# EAGLE design Frankie_DIYRevB (EAGLE 9.3.0)
FRANKIE 1.0
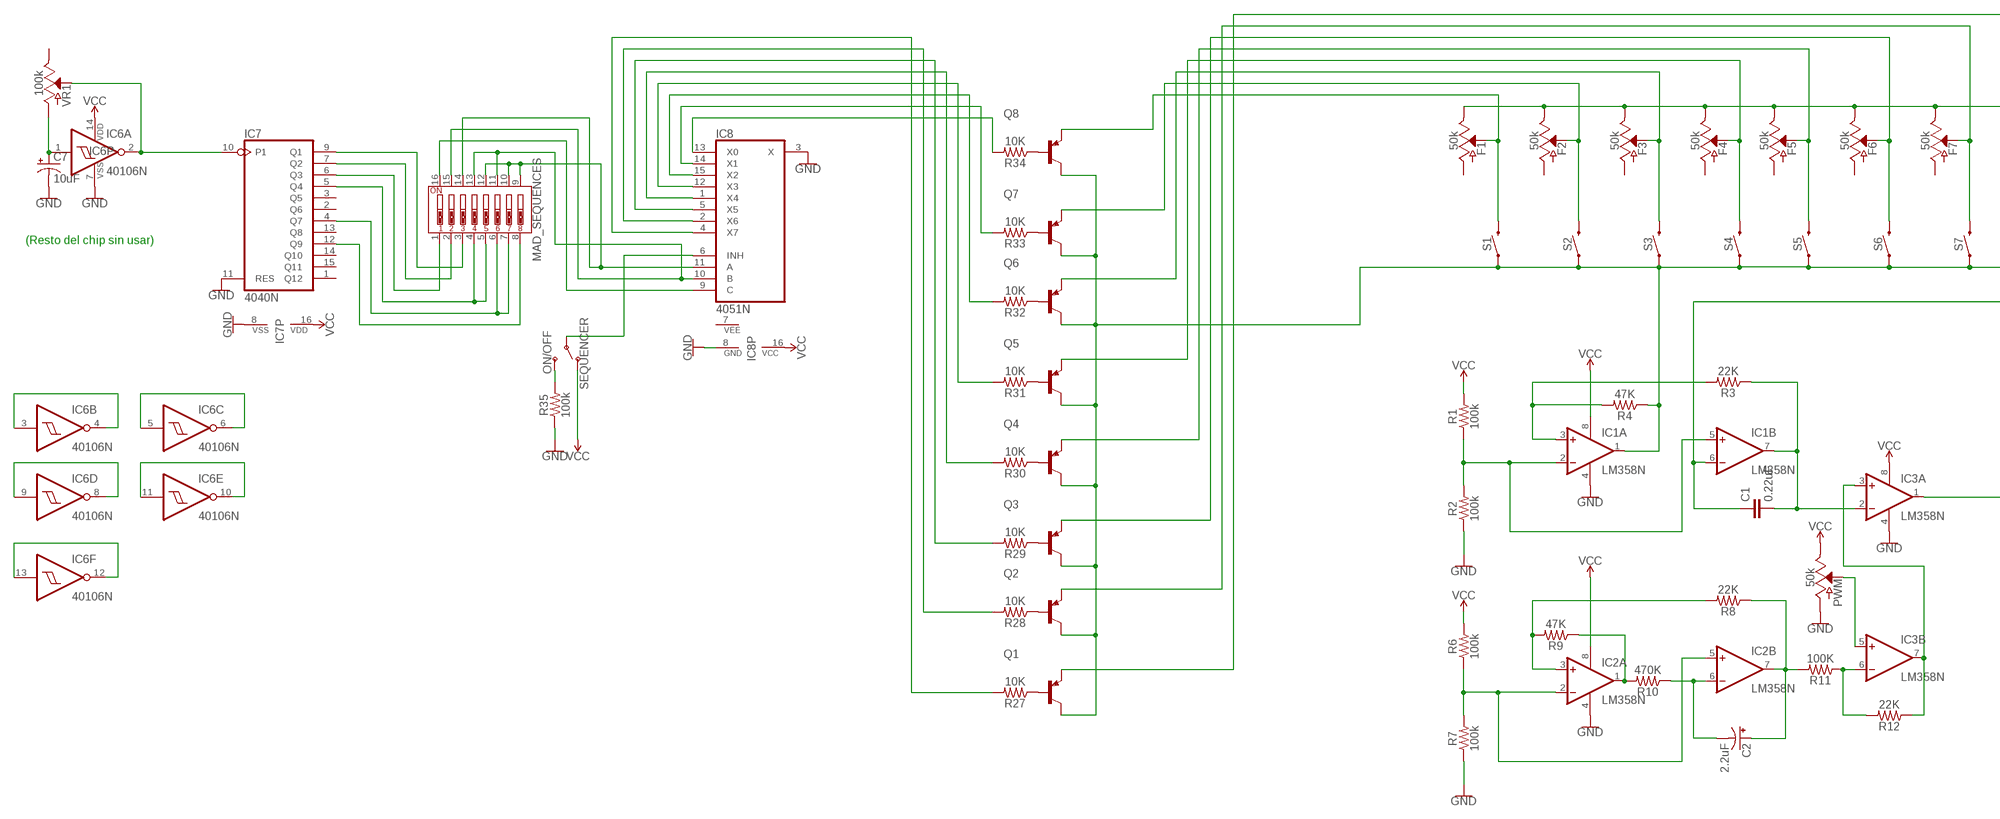
[diagram p0: schematic, sheet 1, part 1 of 2]
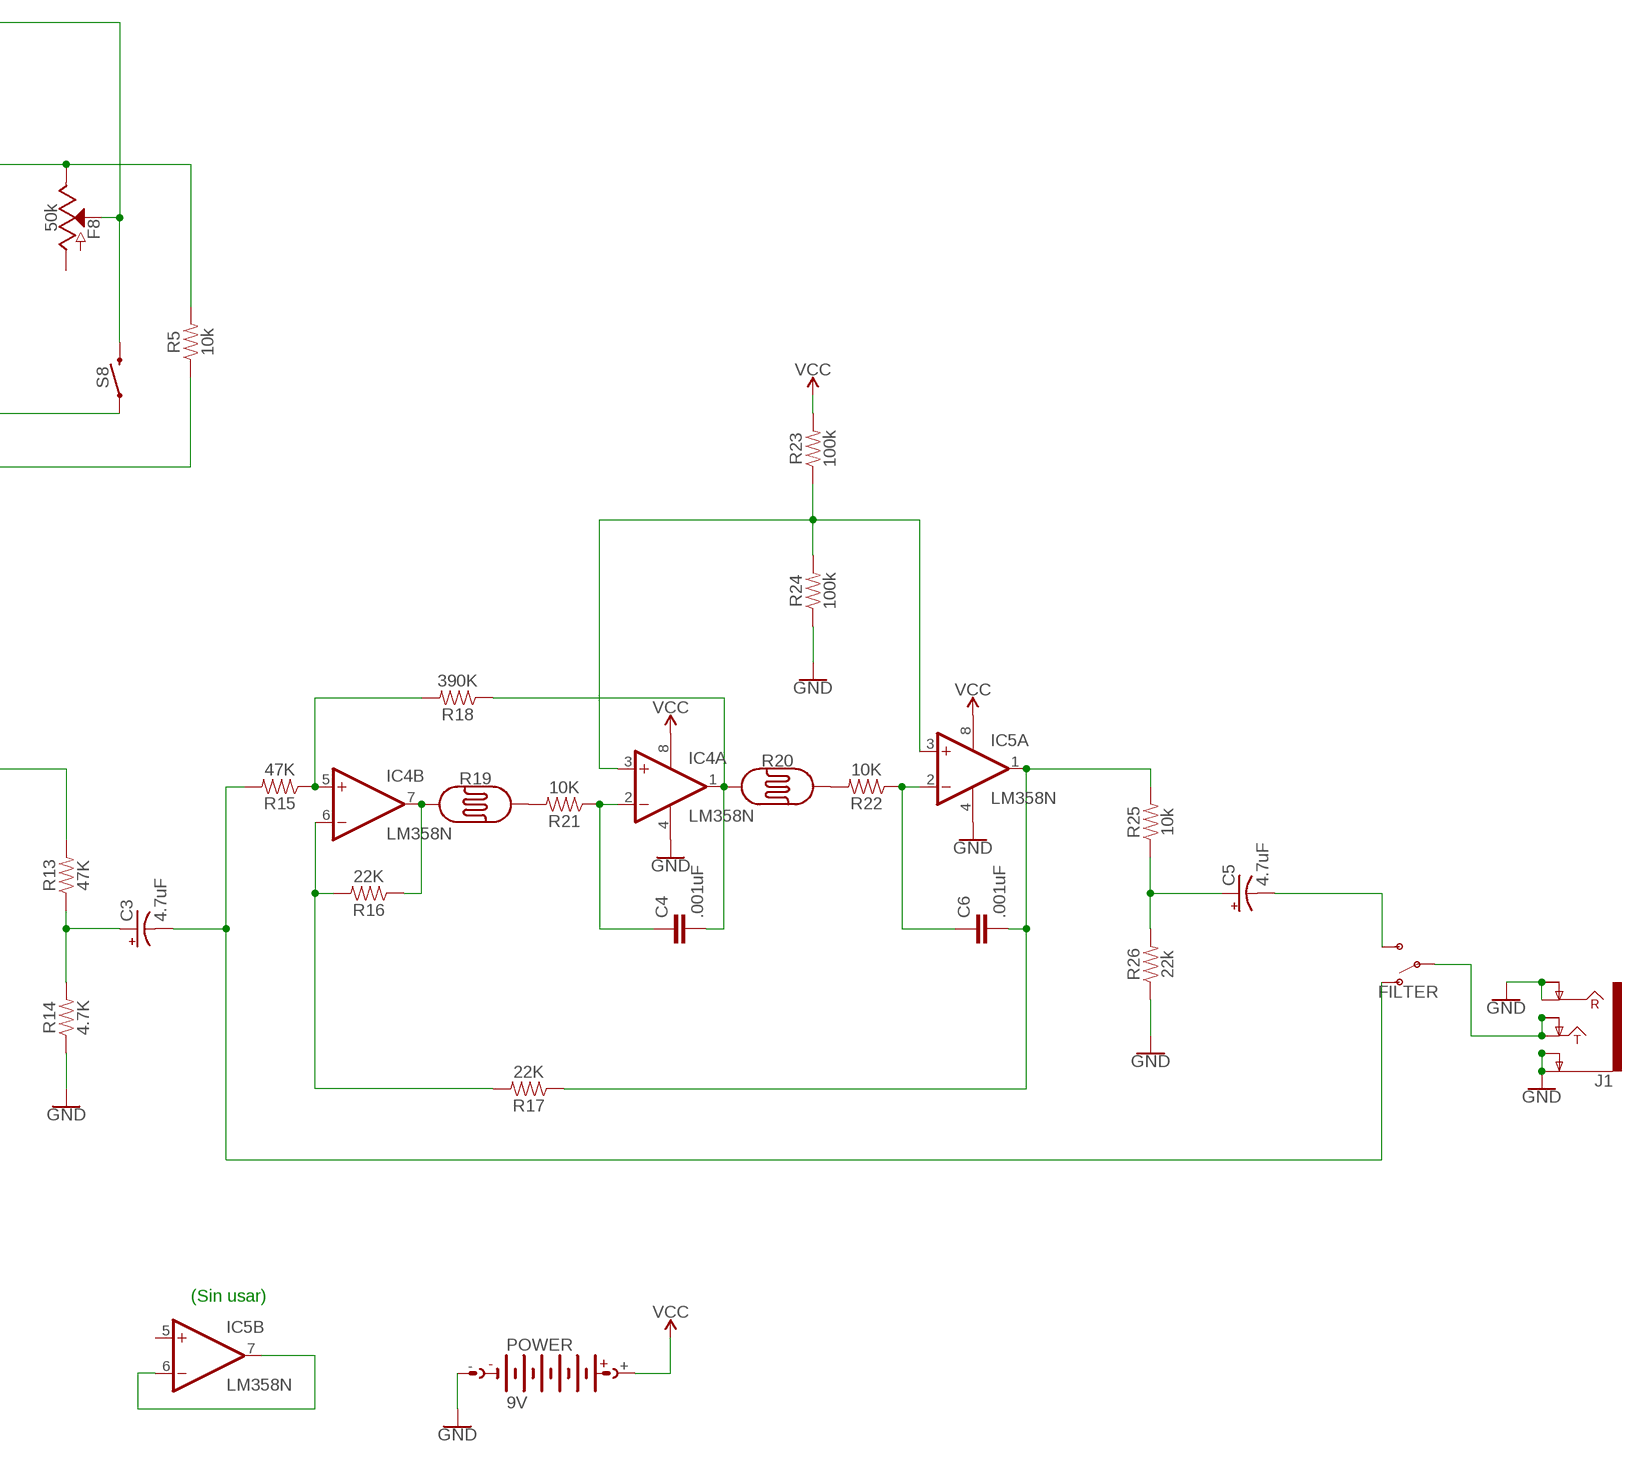
[diagram p1: schematic, sheet 1, part 2 of 2]

## Parts
C1  0.22uF  C5/2.5  [C5B2.5]
C2  2.2uF  10UF-POLAR-RADIAL-2.5MM-KIT-25V-20%  [CPOL-RADIAL-2.5MM-5MM-KIT]
C3  4.7uF  10UF-POLAR-RADIAL-2.5MM-KIT-25V-20%  [CPOL-RADIAL-2.5MM-5MM-KIT]
C4  .001uF  C5/2.5  [C5B2.5]
C5  4.7uF  10UF-POLAR-RADIAL-2.5MM-KIT-25V-20%  [CPOL-RADIAL-2.5MM-5MM-KIT]
C6  .001uF  C5/2.5  [C5B2.5]
C7  10uF  10UF-POLAR-RADIAL-2.5MM-KIT-25V-20%  [CPOL-RADIAL-2.5MM-5MM-KIT]
F1  50k  POTENTIOMETER-PTH-9MM-1/20W-20%-KIT  [POT-PTH-ALPS-KIT]
F2  50k  POTENTIOMETER-PTH-9MM-1/20W-20%-KIT  [POT-PTH-ALPS-KIT]
F3  50k  POTENTIOMETER-PTH-9MM-1/20W-20%-KIT  [POT-PTH-ALPS-KIT]
F4  50k  POTENTIOMETER-PTH-9MM-1/20W-20%-KIT  [POT-PTH-ALPS-KIT]
F5  50k  POTENTIOMETER-PTH-9MM-1/20W-20%-KIT  [POT-PTH-ALPS-KIT]
F6  50k  POTENTIOMETER-PTH-9MM-1/20W-20%-KIT  [POT-PTH-ALPS-KIT]
F7  50k  POTENTIOMETER-PTH-9MM-1/20W-20%-KIT  [POT-PTH-ALPS-KIT]
F8  50k  POTENTIOMETER-PTH-9MM-1/20W-20%-KIT  [POT-PTH-ALPS-KIT]
FILTER  SWITCH-SPDT-PTH-11.6X4.0MM-KIT  [SWITCH_SPDT_PTH_11.6X4.0MM_KIT]
IC1  LM358N  [DIL08]
IC2  LM358N  [DIL08]
IC3  LM358N  [DIL08]
IC4  LM358N  [DIL08]
IC5  LM358N  [DIL08]
IC6  40106N  [DIL14]
IC7  4040N  [DIL16]
IC8  4051N  [DIL16]
J1  AUDIO_JACK_TRS_0.25"_PTH_RA  [AUDIO_JACK_0.25"_TRS_PTH_RA]
MAD_SEQUENCES  DIP-08-PTH  [DIPSWITCH-08]
POWER  9V  AB9V  [AB9V]
PWM  50k  POTENTIOMETER-PTH-9MM-1/20W-20%-KIT  [POT-PTH-ALPS-KIT]
Q1  2N3906  [TO92]
Q2  2N3906  [TO92]
Q3  2N3906  [TO92]
Q4  2N3906  [TO92]
Q5  2N3906  [TO92]
Q6  2N3906  [TO92]
Q7  2N3906  [TO92]
Q8  2N3906  [TO92]
R1  100k  100KOHM-HORIZ-1/4W-5%  [AXIAL-0.3]
R2  100k  100KOHM-HORIZ-1/4W-5%  [AXIAL-0.3]
R3  22K  100KOHM-HORIZ-1/4W-5%  [AXIAL-0.3]
R4  47K  100KOHM-HORIZ-1/4W-5%  [AXIAL-0.3]
R5  10k  100KOHM-HORIZ-1/4W-5%  [AXIAL-0.3]
R6  100k  100KOHM-HORIZ-1/4W-5%  [AXIAL-0.3]
R7  100k  100KOHM-HORIZ-1/4W-5%  [AXIAL-0.3]
R8  22K  100KOHM-HORIZ-1/4W-5%  [AXIAL-0.3]
R9  47K  100KOHM-HORIZ-1/4W-5%  [AXIAL-0.3]
R10  470K  100KOHM-HORIZ-1/4W-5%  [AXIAL-0.3]
R11  100K  100KOHM-HORIZ-1/4W-5%  [AXIAL-0.3]
R12  22K  100KOHM-HORIZ-1/4W-5%  [AXIAL-0.3]
R13  47K  100KOHM-HORIZ-1/4W-5%  [AXIAL-0.3]
R14  4.7K  100KOHM-HORIZ-1/4W-5%  [AXIAL-0.3]
R15  47K  100KOHM-HORIZ-1/4W-5%  [AXIAL-0.3]
R16  22K  100KOHM-HORIZ-1/4W-5%  [AXIAL-0.3]
R17  22K  100KOHM-HORIZ-1/4W-5%  [AXIAL-0.3]
R18  390K  100KOHM-HORIZ-1/4W-5%  [AXIAL-0.3]
R19  PHOTOCELLPTH-KIT  [PHOTOCELL-KIT]
R20  PHOTOCELLPTH-KIT  [PHOTOCELL-KIT]
R21  10K  100KOHM-HORIZ-1/4W-5%  [AXIAL-0.3]
R22  10K  100KOHM-HORIZ-1/4W-5%  [AXIAL-0.3]
R23  100k  100KOHM-HORIZ-1/4W-5%  [AXIAL-0.3]
R24  100k  100KOHM-HORIZ-1/4W-5%  [AXIAL-0.3]
R25  10k  100KOHM-HORIZ-1/4W-5%  [AXIAL-0.3]
R26  22k  100KOHM-HORIZ-1/4W-5%  [AXIAL-0.3]
R27  10K  100KOHM-HORIZ-1/4W-5%  [AXIAL-0.3]
R28  10K  100KOHM-HORIZ-1/4W-5%  [AXIAL-0.3]
R29  10K  100KOHM-HORIZ-1/4W-5%  [AXIAL-0.3]
R30  10K  100KOHM-HORIZ-1/4W-5%  [AXIAL-0.3]
R31  10K  100KOHM-HORIZ-1/4W-5%  [AXIAL-0.3]
R32  10K  100KOHM-HORIZ-1/4W-5%  [AXIAL-0.3]
R33  10K  100KOHM-HORIZ-1/4W-5%  [AXIAL-0.3]
R34  10K  100KOHM-HORIZ-1/4W-5%  [AXIAL-0.3]
R35  100k  100KOHM-HORIZ-1/4W-5%  [AXIAL-0.3]
S1  MOMENTARY-SWITCH-SPST-PTH-12MM  [TACTILE_SWITCH_PTH_12MM]
S2  MOMENTARY-SWITCH-SPST-PTH-12MM  [TACTILE_SWITCH_PTH_12MM]
S3  MOMENTARY-SWITCH-SPST-PTH-12MM  [TACTILE_SWITCH_PTH_12MM]
S4  MOMENTARY-SWITCH-SPST-PTH-12MM  [TACTILE_SWITCH_PTH_12MM]
S5  MOMENTARY-SWITCH-SPST-PTH-12MM  [TACTILE_SWITCH_PTH_12MM]
S6  MOMENTARY-SWITCH-SPST-PTH-12MM  [TACTILE_SWITCH_PTH_12MM]
S7  MOMENTARY-SWITCH-SPST-PTH-12MM  [TACTILE_SWITCH_PTH_12MM]
S8  MOMENTARY-SWITCH-SPST-PTH-12MM  [TACTILE_SWITCH_PTH_12MM]
SEQUENCER  ON/OFF  SWITCH-SPDT-PTH-11.6X4.0MM-KIT  [SWITCH_SPDT_PTH_11.6X4.0MM_KIT]
VR1  100k  POTENTIOMETER-PTH-9MM-1/20W-20%-KIT  [POT-PTH-ALPS-KIT]

## Nets
GND [ground]: C7.2(-) IC1.4(P:V-) IC2.4(P:V-) IC3.4(P:V-) IC4.4(P:V-) IC5.4(P:V-) IC6.7(P:VSS) IC7.8(VSS) IC7.11(RES) IC8.3(X) IC8.8(GND) J1.RING J1.RING-NORM J1.SLEEVE(EARTH) J1.SLEEVE-NORM(EARTH-NORM) POWER.- PWM.P$3(A) R2.P$1 R7.P$1 R14.P$1 R24.P$1 R26.P$1 R35.P$1
N$1: IC1.2(A:-IN) IC1.5(B:+IN) R1.P$1 R2.P$2
N$2: C1.2 IC1.7(B:OUT) IC3.2(A:-IN) R3.P$1
N$3: IC1.3(A:+IN) R3.P$2 R4.P$2
N$4: C1.1 IC1.6(B:-IN) R5.P$1
N$5: IC1.1(A:OUT) Q1.1(C) Q2.1(C) Q3.1(C) Q4.1(C) Q5.1(C) Q6.1(C) Q7.1(C) Q8.1(C) R4.P$1 S1.1 S2.1 S3.1 S4.1 S5.1 S6.1 S7.1 S8.1
N$6: F1.P$2(S) Q8.3(E) S1.3
N$7: F2.P$2(S) Q7.3(E) S2.3
N$8: IC7.5(Q4) MAD_SEQUENCES.4 MAD_SEQUENCES.5
N$9: F4.P$2(S) Q5.3(E) S4.3
N$10: F5.P$2(S) Q4.3(E) S5.3
N$11: F6.P$2(S) Q3.3(E) S6.3
N$12: F7.P$2(S) Q2.3(E) S7.3
N$13: F8.P$2(S) Q1.3(E) S8.3
N$14: F1.P$1(E) F2.P$1(E) F3.P$1(E) F4.P$1(E) F5.P$1(E) F6.P$1(E) F7.P$1(E) F8.P$1(E) R5.P$2
N$15: IC2.2(A:-IN) IC2.5(B:+IN) R6.P$1 R7.P$2
N$16: IC2.3(A:+IN) R8.P$2 R9.P$2
N$17: IC2.1(A:OUT) R9.P$1 R10.P$2
N$18: C2.2(-) IC2.6(B:-IN) R10.P$1
N$19: IC3.6(B:-IN) R11.P$1 R12.P$2
N$20: C2.1(+) IC2.7(B:OUT) R8.P$1 R11.P$2
N$21: IC3.5(B:+IN) PWM.P$2(S)
N$22: IC3.3(A:+IN) IC3.7(B:OUT) R12.P$1
N$23: IC3.1(A:OUT) R13.P$2
N$25: C3.1(+) R13.P$1 R14.P$2
N$26: IC4.5(B:+IN) R15.P$1 R18.P$2
N$27: C3.2(-) FILTER.1(O) R15.P$2
N$28: IC4.6(B:-IN) R16.P$2 R17.P$2
N$29: IC4.7(B:OUT) R16.P$1 R19.1
N$30: C6.2 IC5.1(A:OUT) R17.P$1 R25.P$2
N$31: C4.2 IC4.1(A:OUT) R18.P$1 R20.1
N$32: R19.2 R21.P$2
N$33: R20.2 R22.P$2
N$34: C4.1 IC4.2(A:-IN) R21.P$1
N$35: C6.1 IC5.2(A:-IN) R22.P$1
N$36: IC5.6(B:-IN) IC5.7(B:OUT)
N$37: IC4.3(A:+IN) IC5.3(A:+IN) R23.P$1 R24.P$2
N$38: C5.1(+) R25.P$1 R26.P$2
N$39: FILTER.2(P) J1.TIP J1.TIP-NORM
N$40: Q1.2(B) R27.P$1
N$41: C5.2(-) FILTER.3(S)
N$42: Q2.2(B) R28.P$1
N$43: Q3.2(B) R29.P$1
N$44: Q4.2(B) R30.P$1
N$45: Q5.2(B) R31.P$1
N$46: Q6.2(B) R32.P$1
N$47: Q7.2(B) R33.P$1
N$48: Q8.2(B) R34.P$1
N$49: C7.1(+) IC6.1(A:I) VR1.P$3(A)
N$50: IC6.2(A:O) IC7.10(P1) VR1.P$2(S)
N$51: IC7.9(Q1) MAD_SEQUENCES.3
N$52: IC7.12(Q9) MAD_SEQUENCES.8
N$53: IC7.6(Q3) MAD_SEQUENCES.1
N$54: IC8.11(A) MAD_SEQUENCES.9 MAD_SEQUENCES.10 MAD_SEQUENCES.12 MAD_SEQUENCES.14
N$55: IC8.10(B) MAD_SEQUENCES.11 MAD_SEQUENCES.13 MAD_SEQUENCES.15
N$56: IC8.9(C) MAD_SEQUENCES.16
N$57: IC8.6(INH) SEQUENCER.2(P)
N$58: R35.P$2 SEQUENCER.3(S)
N$59: IC8.13(X0) R34.P$2
N$60: IC8.14(X1) R33.P$2
N$61: IC8.15(X2) R32.P$2
N$62: IC8.12(X3) R31.P$2
N$63: IC8.1(X4) R30.P$2
N$64: IC8.5(X5) R29.P$2
N$65: IC8.2(X6) R28.P$2
N$66: IC8.4(X7) R27.P$2
N$67: IC7.7(Q2) MAD_SEQUENCES.2
N$68: IC7.4(Q7) MAD_SEQUENCES.6 MAD_SEQUENCES.7
N$69: F3.P$2(S) Q6.3(E) S3.3
N$70: IC6.3(B:I) IC6.4(B:O)
N$71: IC6.5(C:I) IC6.6(C:O)
N$72: IC6.8(D:O) IC6.9(D:I)
N$73: IC6.10(E:O) IC6.11(E:I)
N$74: IC6.12(F:O) IC6.13(F:I)
VCC: IC1.8(P:V+) IC2.8(P:V+) IC3.8(P:V+) IC4.8(P:V+) IC5.8(P:V+) IC6.14(P:VDD) IC7.16(VDD) IC8.16(VCC) POWER.+ PWM.P$1(E) R1.P$2 R6.P$2 R23.P$2 SEQUENCER.1(O)
Unconnected: F1.P$3(A) F2.P$3(A) F3.P$3(A) F4.P$3(A) F5.P$3(A) F6.P$3(A) F7.P$3(A) F8.P$3(A) IC5.5(B:+IN) IC7.1(Q12) IC7.2(Q6) IC7.3(Q5) IC7.13(Q8) IC7.14(Q10) IC7.15(Q11) VR1.P$1(E)

## Notes on the sheet
- (Resto del chip sin usar)
- (Sin usar)

## Power pins joined to a net without a drawn wire
VEE: IC8.7(VEE)

## Library data of the parts
C1 C4 C6 = capacitor-wima:C: CAPACITOR naming: grid - package width
C2 C3 C5 = SparkFun-Capacitors:10UF-POLAR: 10.0µF polarized capacitors A capacitor is a passive two-terminal electrical component used to store electrical energy temporarily in an electric field.; PROD_ID: CAP-08440; VALUE: 10uF
C7 = SparkFun-Capacitors:10UF-POLAR: 10.0µF polarized capacitors A capacitor is a passive two-terminal electrical component used to store electrical energy temporarily in an electric field.; PROD_ID: CAP-08440
F1-F8 PWM VR1 = SparkFun-Resistors:POTENTIOMETER: Potentiometer (Pot) Three-terminal potentiometers, with an adjustable wiper and two adjustable resistors. A pot can be used to create a configurable voltage divider, or as a variable resistor. Variants ALPS_POT and ALPS_POT_KIT - PTH, breadboard compatible, 9mm square pots Rotary Potentiometer - Linear (10k ohm) <https://www.sparkfun.com/products/9288> (COM-09288) The KIT variant exposes copper on only one side of the PTH pad, so the part can only be assembled on one side of the PCB. Useful for beginner soldering kits.; PROD_ID: RES-09177; SF_SKU: COM-09288; VALUE: 10k
FILTER SEQUENCER = SparkFun-Switches:SWITCH-SPDT: Single Pole, Double Throw (SPDT) Switch Single-pole, double-throw (SPDT) switch. Variant Overview SMD-AYZ0202 Surface Mount DPDT Switch <https://www.sparkfun.com/products/597> (COM-00597) Used on e.g. LilyPad Arduino USB - ATmega32U4 Board <https://www.sparkfun.com/products/12049> PTH-11.6X4.0MM SPDT Mini Power Switch <https://www.sparkfun.com/products/102> (COM-00102) Used on e.g. SparkFun Simon Says - Through-Hole Soldering Kit <https://www.sparkfun.com/products/10547> (KIT-10547) PTH-11.6X4.0MM-KIT KIT version of SPDT Mini Power Switch - Simplifies soldering by removing tStop of switch pins - only one side can be soldered. PTH-11.6X4.0MM-LOCK LOCK version of SPDT Mini Power Switch - Offset pins hold switch in place for easier soldering. SMD-RIGHT-ANGLE Surface Mount Right Angle Switch <https://www.sparkfun.com/products/10860> (COM-10860) Used on e.g. SparkFun ESP8266 Thing <https://www.sparkfun.com/products/13231>; PROD_ID: SWCH-08261; SF_SKU: COM-00102
IC1-IC5 = linear:LM358: OP AMP also LM158; LM258; LM2904 Source: http://cache.national.com/ds/LM/LM158.pdf
IC6 = 40xx:40106: Hex SCHMITT TRIGGER
IC7 = 40xx:4040: 12-stage binary/ripple COUNTER
IC8 = 40xx:4051: 8-channel ANALOG MULTIPLEXER
J1 = SparkFun-Connectors:AUDIO_JACK_TRS_0.25"_PTH_RA: Audio Jack, 1/4" TRS jack, horizontal, PTH, aka "Phono jack" Find the connector here: Audio Jack - 1/4" Stereo (right angle) <https://www.sparkfun.com/products/11144> (COM-11144) Datasheet <http://cdn.sparkfun.com/datasheets/Components/General/JP-611%20DD.jpg> Note, although the datasheet and physical part are slightly different, this footprint was proven to mate well on the Proto Pedal. This device is used on these SparkFun Products: SparkFun TRS Jack Breakout - 1/4" Stereo <https://www.sparkfun.com/products/13005> (BOB-13005 ) SparkFun Proto Pedal - sorry bad link - product comming soon! <https://www.sparkfun.com/products/13124> (PRT-13124); PROD_ID: CONN-12339; SF_ID: COM-11144
MAD_SEQUENCES = SparkFun-Switches:DIP-08: 8-Position DIP Switch 8-circuit DIP (dual inline package) switch. Commonly used to physcially set a circuit's behavior. SparkFun Products DIP Switch - 8 Position <https://www.sparkfun.com/products/8034> (COM-08034); PROD_ID: SWCH-12197; SF_SKU: COM-08034
POWER = battery:AB9V: 9-V BATTERY CLIP
Q1-Q8 = transistor-pnp:2N3906: PNP Transistor
R1 R2 R6 R7 R23 R24 R35 = SparkFun-Resistors:100KOHM: 100kΩ resistor A resistor is a passive two-terminal electrical component that implements electrical resistance as a circuit element. Resistors act to reduce current flow, and, at the same time, act to lower voltage levels within circuits. - Wikipedia; PROD_ID: RES-10686
R3-R5 R8-R18 R21 R22 R25-R34 = SparkFun-Resistors:100KOHM: 100kΩ resistor A resistor is a passive two-terminal electrical component that implements electrical resistance as a circuit element. Resistors act to reduce current flow, and, at the same time, act to lower voltage levels within circuits. - Wikipedia; PROD_ID: RES-10686; VALUE: 100k
R19 R20 = SparkFun-Sensors:PHOTOCELL: Photocell (Photodetector, Photo Resistor, CdS) This is a very small light sensor. A photocell changes (also called a photodetector, photo resistor, CdS or photoconductive cell) resistance depending on the amount of light it is exposed to. These little sensors make great ambient light triggers (when light in the room turns on, do something). Datasheet <http://cdn.sparkfun.com/datasheets/Sensors/LightImaging/SEN-09088.pdf> SparkFun Products Mini Photocell <https://www.sparkfun.com/products/9088> (SEN-09088); PROD_ID: COMP-09129; SF_ID: SEN-09088
S1-S8 = SparkFun-Switches:MOMENTARY-SWITCH-SPST: Momentary Switch (Pushbutton) - SPST Normally-open (NO) SPST momentary switches (buttons, pushbuttons). Variants PTH-12MM - 12mm square, through-hole Momentary Pushbutton Switch - 12mm Square <https://www.sparkfun.com/products/9190> (COM-09190) PTH-6.0MM, PTH-6.0MM-KIT - 6.0mm square, through-hole Mini Pushbutton Switch <https://www.sparkfun.com/products/97> (COM-00097) KIT package intended for soldering kit's - only one side of pads' copper is exposed. PTH-RIGHT-ANGLE-KIT - Right-angle, through-hole Right Angle Tactile Button <https://www.sparkfun.com/products/10791> - Used on SparkFun BigTime Watch Kit <https://www.sparkfun.com/products/11734> SMD-12MM - 12mm square, surface-mount Tactile Button - SMD (12mm) <https://www.sparkfun.com/products/12993> (COM-12993) Used on SparkFun PicoBoard <https://www.sparkfun.com/products/11888> SMD-4.5MM - 4.5mm Square Trackball Switch Used on SparkFun Blackberry Trackballer Breakout <https://www.sparkfun.com/products/13169> SMD-4.6MMX2.8MM - 4.60mm x 2.80mm, surface mount Used on SparkFun SAMD21 Mini Breakout <https://www.sparkfun.com/products/13664> SMD-5.2MM, SMD-5.2-REDUNDANT - 5.2mm square, surface-mount Mini Pushbutton Switch - SMD <https://www.sparkfun.com/products/8720> (COM-08720) Used on Arduino Pro Mini <https://www.sparkfun.com/products/11114> REDUNDANT package connects both switch circuits together SMD-6.0X3.5MM - 6.0 x 3.5mm, surface mount Momentary Reset Switch SMD <https://www.sparkfun.com/products/8229> (COM-08229) SMD-6.2MM-TALL - 6.2mm square, surface mount Tactile Button - SMD (6mm) <https://www.sparkfun.com/products/12992> Used on SparkFun Digital Sandbox <https://www.sparkfun.com/products/12651> SMD-RIGHT-ANGLE - Right-angle, surface mount Used on SparkFun Block for Intel® Edison - Arduino <https://www.sparkfun.com/products/13036>; PROD_ID: SWCH-09185; SF_SKU: COM-09190

## Net classes
0 default: width 0.406 mm
1 ground: width 0.61 mm

## Board
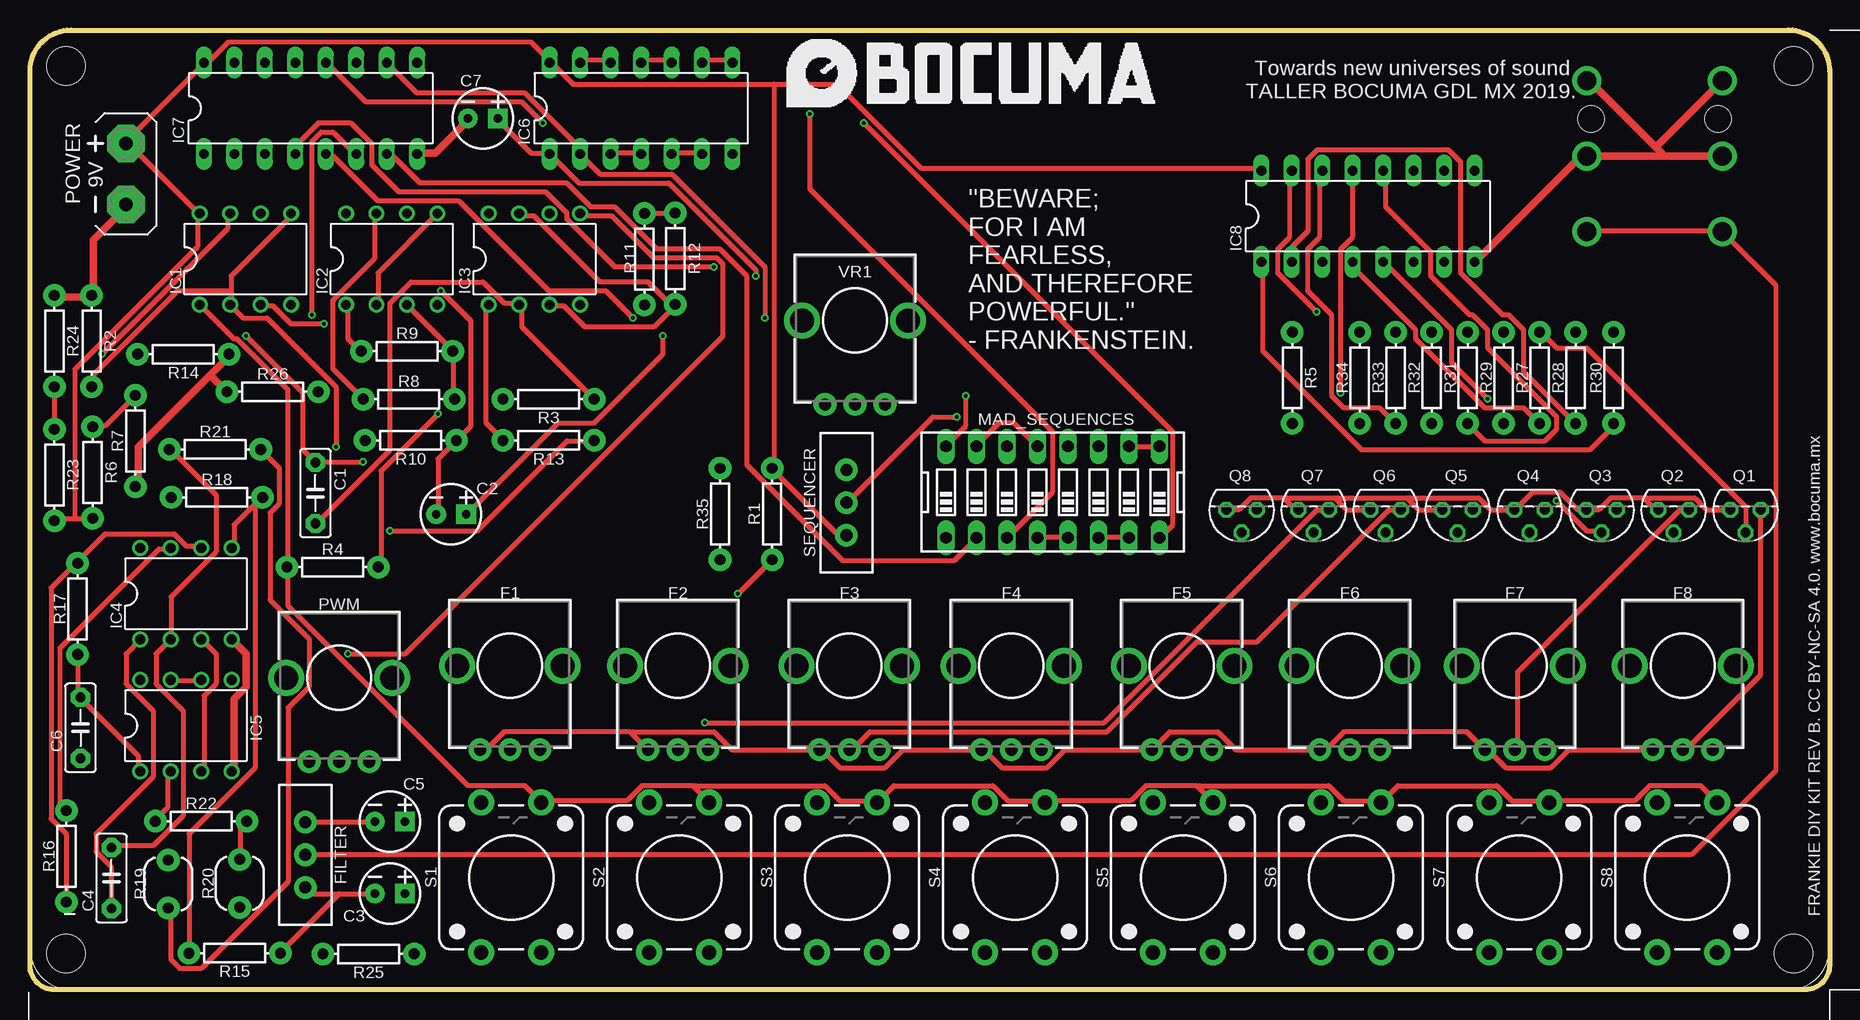
[diagram p2: board, top side]
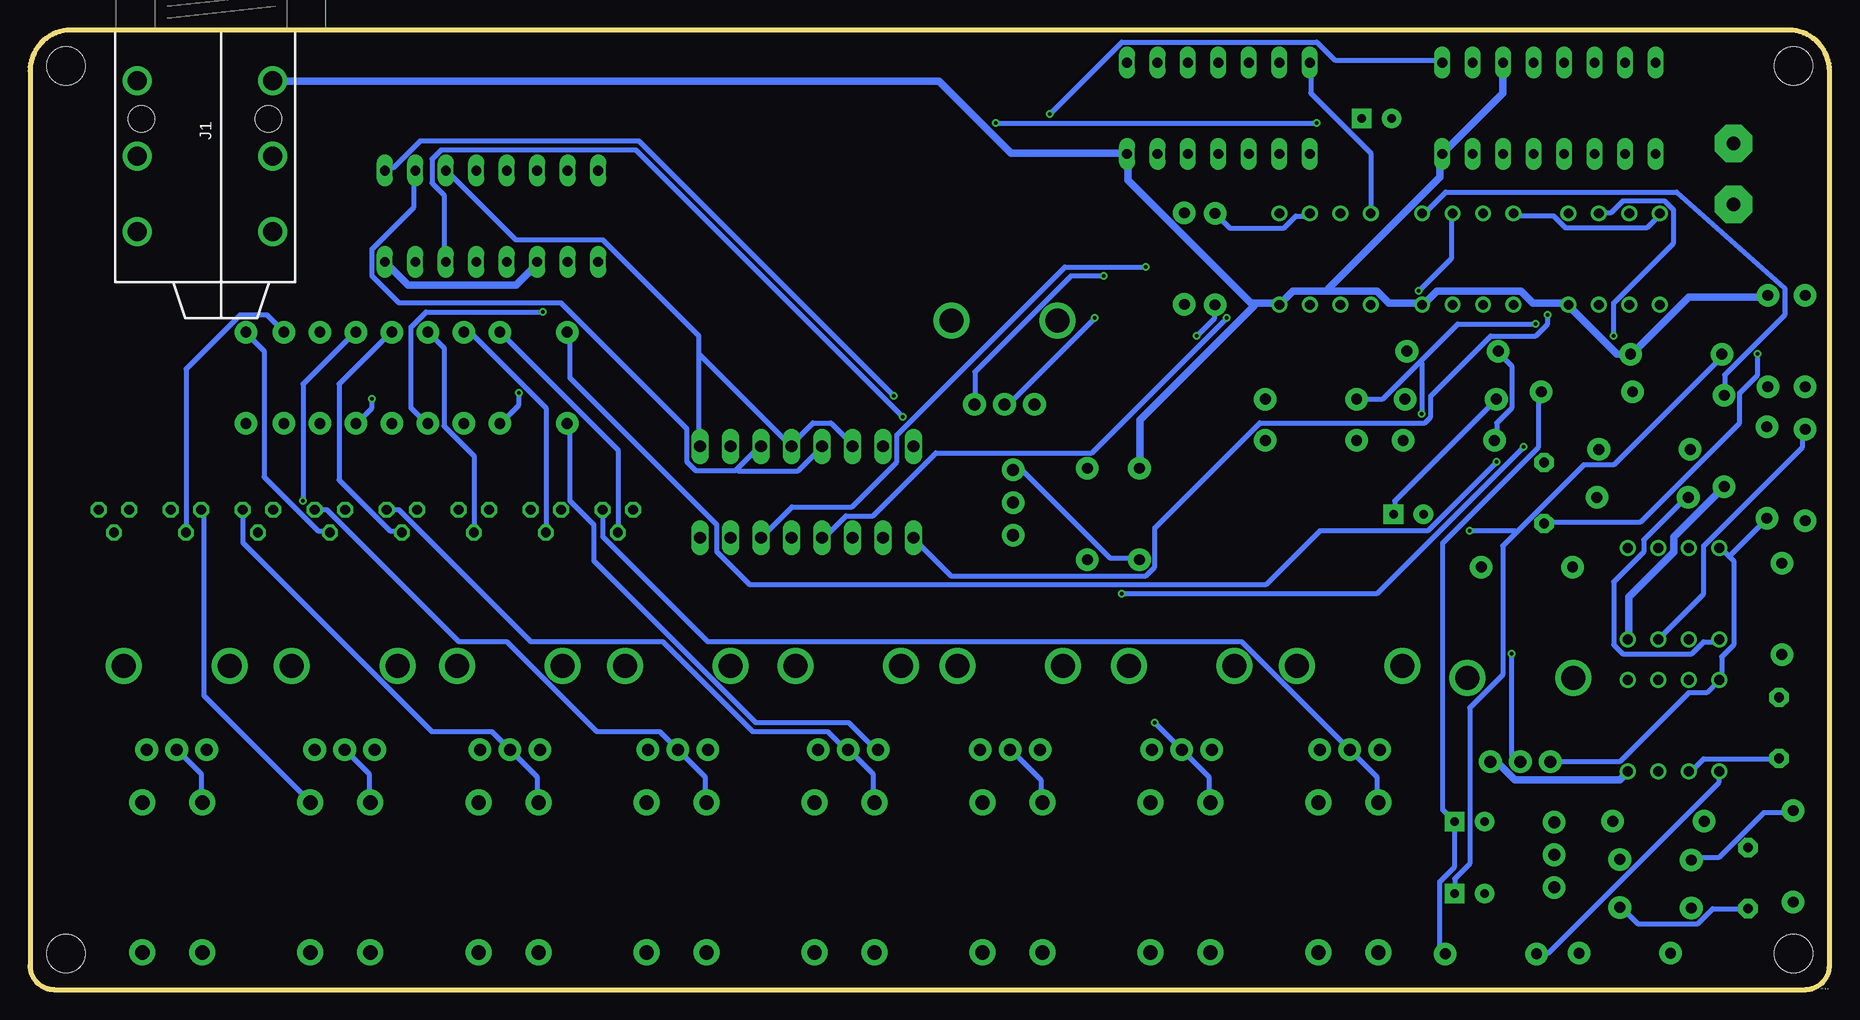
[diagram p3: board, bottom side, seen from below]

Size 150 x 80 mm. Coordinates in mm from the lower left corner, seen from the top.
Outline: 148,0 2,0 arc-90 0,2 0,76.59 arc-90 3.41,80 146.59,80 arc-90 150,76.59 150,2 arc-90 148,0
Copper layers (1*16): Top 0.035mm / dielectric 1.5mm / Bottom 0.035mm
Design rules "dirt_cheap_dirty_boards.v1": minimum track width 5mil, minimum drill 12mil, track to track 5mil, track to pad 5mil, pad to pad 5mil, via to via 5mil, smd to smd 0mil, copper to edge 10mil, drill to drill 10mil, minimum pad ring 10mil, minimum via ring 6mil, stop-mask expansion 2mil, vias tented up to drill 25mil, thermal gap 10mil
Holes 3.2 mm at 3,3 147,77 147,3 3,77

### Footprints (pad centres in the part's own frame; a part is rotated, then mirrored left to right if it is on the bottom)
C5B2.5 = drill 0.813 pad 1.6 octagon: 1 -2.54,0; 2 2.54,0
CPOL-RADIAL-2.5MM-5MM-KIT = drill 0.7 pad 1.651 square: 1 1.25,0 | drill 0.7 pad 1.651: 2 -1.25,0
POT-PTH-ALPS-KIT = drill 1 pad 1.88: P$1 7,-2.5; P$2 7,0; P$3 7,2.5 | drill 2: P$4 0,-4.4; P$5 0,4.4
SWITCH_SPDT_PTH_11.6X4.0MM_KIT = drill 1.016 pad 1.88: 1 0,2.718; 2 0,0; 3 0,-2.718
DIL08 = drill 0.813 pad 1.27: 1 -3.81,-3.81; 2 -1.27,-3.81; 3 1.27,-3.81; 4 3.81,-3.81; 5 3.81,3.81; 6 1.27,3.81; 7 -1.27,3.81; 8 -3.81,3.81
DIL14 = drill 0.813 long: 1 -7.62,-3.81; 2 -5.08,-3.81; 3 -2.54,-3.81; 4 0,-3.81; 5 2.54,-3.81; 6 5.08,-3.81; 7 7.62,-3.81; 8 7.62,3.81; 9 5.08,3.81; 10 2.54,3.81; 11 0,3.81; 12 -2.54,3.81; 13 -5.08,3.81; 14 -7.62,3.81
DIL16 = drill 0.813 long: 1 -8.89,-3.81; 2 -6.35,-3.81; 3 -3.81,-3.81; 4 -1.27,-3.81; 5 1.27,-3.81; 6 3.81,-3.81; 7 6.35,-3.81; 8 8.89,-3.81; 9 8.89,3.81; 10 6.35,3.81; 11 3.81,3.81; 12 1.27,3.81; 13 -1.27,3.81; 14 -3.81,3.81; 15 -6.35,3.81; 16 -8.89,3.81
AUDIO_JACK_0.25"_TRS_PTH_RA = drill 1.6: RING 10.5,-6.95; RING-NORM 10.5,4.35; SLEEVE 4.2,-6.95; SLEEVE-NORM 4.2,4.35; TIP 16.8,-6.95; TIP-NORM 16.8,4.35 | hole 2.2: 7.4,4; 7.4,-6.6
DIPSWITCH-08 = drill 0.97 long: 1 -8.89,-3.81; 2 -6.35,-3.81; 3 -3.81,-3.81; 4 -1.27,-3.81; 5 1.27,-3.81; 6 3.81,-3.81; 7 6.35,-3.81; 8 8.89,-3.81; 9 8.89,3.81; 10 6.35,3.81; 11 3.81,3.81; 12 1.27,3.81; 13 -1.27,3.81; 14 -3.81,3.81; 15 -6.35,3.81; 16 -8.89,3.81
AB9V = drill 1.118 pad 3.15 octagon: + 0,2.54; - 0,-2.54
TO92 = drill 0.813 octagon: 1 1.27,0; 2 0,1.905; 3 -1.27,0
AXIAL-0.3 = drill 0.9 pad 1.88: P$1 -3.81,0; P$2 3.81,0
PHOTOCELL-KIT = drill 0.9 pad 1.88: 1 -2,0; 2 2,0
TACTILE_SWITCH_PTH_12MM = drill 1.2 pad 2.159: 1 6.25,-2.5; 2 -6.25,-2.5; 3 6.25,2.5; 4 -6.25,2.5

### Placement (x,y rotation side)
C1  23.79,41.4 270 top
C2  35.1,39.63 0 top
C3  30,8 0 top
C4  6.79,9.29 270 top
C5  30,14 0 top
C6  4.21,21.82 90 top
C7  37.75,72.63 0 top
F1  40,27 270 top
F2  54,27 270 top
F3  68.3,27 270 top
F4  81.8,27 270 top
F5  96,27 270 top
F6  110,27 270 top
F7  123.77,27 270 top
F8  137.77,27 270 top
FILTER  22.95,11.23 180 top
IC1  17.95,60.9 0 top
IC2  30.15,60.9 0 top
IC3  42.05,60.9 0 top
IC4  13,33 0 top
IC5  13,22 0 top
IC6  50.94,73.47 0 top
IC7  23.39,73.47 0 top
IC8  111.53,64.47 0 top
J1  134.11,79.98 270 bottom
MAD_SEQUENCES  85.25,41.47 0 top
POWER  8,68 0 top
PWM  25.77,26 270 top
Q1  143,40 180 top
Q2  137,40 180 top
Q3  131,40 180 top
Q4  125,40 180 top
Q5  119,40 180 top
Q6  113,40 180 top
Q7  107,40 180 top
Q8  101,40 180 top
R1  61.86,39.64 90 top
R2  5.14,54.06 270 top
R3  43.22,49.22 180 top
R4  25.22,35.22 0 top
R5  105.22,51 270 top
R6  5.22,43.1 270 top
R7  8.78,45.74 90 top
R8  31.58,49.22 0 top
R9  31.42,53.22 0 top
R10  31.74,45.78 180 top
R11  51.22,60.9 270 top
R12  53.78,60.94 90 top
R13  43.22,45.78 180 top
R14  12.78,52.97 180 top
R15  17.06,3.03 0 top
R16  3.03,11.1 270 top
R17  3.97,31.74 90 top
R18  15.58,41.03 0 top
R19  11.52,8.8 270 top
R20  17.48,8.85 90 top
R21  15.42,45.03 0 top
R22  14.26,14.03 0 top
R23  2.03,42.9 270 top
R24  2.03,54.06 270 top
R25  28.22,2.97 180 top
R26  20.22,49.84 0 top
R27  125.84,51 270 top
R28  128.84,51 270 top
R29  122.84,51 270 top
R30  132,51 270 top
R31  119.84,51 270 top
R32  116.84,51 270 top
R33  113.84,51 270 top
R34  110.84,51 270 top
R35  57.52,39.64 270 top
S1  40.11,9.34 90 top
S2  54.11,9.34 90 top
S3  68.11,9.34 90 top
S4  82.11,9.34 90 top
S5  96.11,9.34 90 top
S6  110.11,9.34 90 top
S7  124.14,9.34 90 top
S8  138.14,9.34 90 top
SEQUENCER  68.05,40.6 180 top
VR1  68.77,55.79 270 top

### Tracks (layer width: path | path; a pad name or v marks a point on that pad's centre or on a via)
GND
  Top 0.61: IC4.4 18,28 18,25.25 17,24.25 17,18.25 IC5.4 | R24.P$1 2.25,57.75 5,57.75 R2.P$1 5.25,58 5.25,62.5 8,65.25 POWER.- | 15,51.25 16.5,52.75 R14.P$1 | 15,51.25 9,45.25 9,42 R7.P$1 | 15,51.25 R26.P$1 | 136,69.5 141,69.5 J1.RING | 136,69.5 130,69.5 J1.RING-NORM 129.5,69.5 129.25,69.5 120.5,60.75 IC8.8 | 135.5,70.25 136,69.75 136,69.5 | 135.5,70.25 130,75.75 J1.SLEEVE-NORM | 135.5,70.25 141,75.75 J1.SLEEVE | IC7.8 32.5,69.75 33.75,69.75 36.5,72.5 C7.2
  Bottom 0.61: PWM.P$3 27.75,19 26.25,17.5 17.5,17.5 IC5.4 | R2.P$1 5.25,57.75 11.75,57.75 16.5,53 R14.P$1 16.75,53 17.75,53 21.75,57 IC1.4 22,57.25 24.75,57.25 25.75,58.25 32.75,58.25 33.75,57.25 IC2.4 34,57.25 36.75,57.25 37.75,58.25 41.75,58.25 | IC4.4 16.75,29.25 16.75,32.75 13,36.5 13,37.75 9,41.75 R7.P$1 | IC8.3 107.75,60.5 109.5,58.75 118.5,58.75 120.25,60.5 IC8.8 | IC7.11 27.25,77.25 27.25,74.75 32.25,69.75 IC7.8 32.5,69.5 32.5,67.75 41.75,58.5 41.75,58.25 | 41.75,58.25 44.75,58.25 45.75,57.25 IC3.4 46,57.25 48,57.25 | 48,57.25 48.25,57.25 58.5,67.5 58.5,69.5 IC6.7 58.75,69.75 68.25,69.75 74.25,75.75 129.75,75.75 J1.SLEEVE-NORM | R35.P$1 57.5,43.5 57.5,47.5 48,57 48,57.25
N$1  (via drill 0.3)
  Top 0.406: 16.75,58.25 16.75,59.5 21.75,64.5 IC1.5 | 16.75,58.25 16.75,57.25 IC1.2 16.75,57 17.75,56 19.75,56 25.5,50.25 v25.5,45.25 | 16.75,58.25 12.25,58.25 5.25,51.25 5.25,50.25 R2.P$2 | v59,33 61.75,35.75 R1.P$1
  Bottom 0.406: v59,33 37.75,33 v25.5,45.25
N$2  (via drill 0.3)
  Top 0.406: R3.P$1 41,55.25 41,57 IC3.2 40.75,57.25 39.5,57.25 37.75,59 31.75,59 30,57.25 30,45 24,39 C1.2 | v6,53 16.5,63.5 16.5,64.5 IC1.7
  Bottom 0.406: v6,53 6,51.25 7.5,49.75 7.5,47.25 15.75,39 23.75,39 C1.2
N$3  (via drill 0.3)
  Top 0.406: v24.5,55.5 21.75,55.5 20.25,57 19.25,57 IC1.3 | v34,48 29.25,43.25 29.25,35.25 R4.P$2
  Bottom 0.406: v24.5,55.5 31,55.5 34.12,52.38 | 34.12,52.38 37.25,49.25 39.25,49.25 R3.P$2 | v34,48 34,52.25 34.12,52.38
N$4  (via drill 0.3)
  Top 0.406: v18,54.5 22.75,49.75 22.75,45 23.75,44 C1.1 24,44 v27.75,44
  Bottom 0.406: v18,54.5 18,57.25 13,62.25 13,65 13.75,65.75 17.25,65.75 18.25,64.75 19,64.75 IC1.6 | v27.75,44 33.5,38.25 42.5,38.25 47,33.75 90,33.75 92.75,36.5 92.75,38.75 105,51 105,54.75 R5.P$1
N$5
  Top 0.406: 134.62,40.88 135.5,40 Q2.1 | 134.62,40.88 134.5,41 131.75,41 130.75,40 Q3.1 129,40 127.5,41.5 125.25,41.5 123.75,40 Q4.1 121.75,40 120.75,41 115,41 114.88,40.88 | Q1.1 139.75,40 138.75,41 134.75,41 134.62,40.88 | Q8.1 100.75,40 101.75,41 104.5,41 104.62,40.88 | 104.62,40.88 105.5,40 Q7.1 | Q6.1 109.75,40 108.88,40.88 | 108.88,40.88 108.75,41 104.75,41 104.62,40.88 | Q5.1 115.75,40 114.88,40.88 | 114.88,40.88 114.75,41 109,41 108.88,40.88 | S8.1 140.5,15.75 139.25,17 135,17 133.75,15.75 126.75,15.75 S7.1 126.5,15.75 123.5,15.75 122.25,17 114,17 112.75,15.75 S6.1 112.5,15.75 109.5,15.75 108.25,17 97.5,17 97.38,16.88 | 97.38,16.88 98.5,15.75 S5.1 | 97.38,16.88 97.25,17 93,17 91.75,15.75 84.75,15.75 S4.1 84.5,15.75 81.5,15.75 80.25,17 72,17 70.75,15.75 S3.1 70.5,15.75 67.5,15.75 66.25,17 55.5,17 55.38,16.88 | IC1.1 14.25,57 17,54.25 17.25,54.25 21.5,50 21.5,35.25 R4.P$1 21.5,35 21.5,32 36.5,17 41.25,17 42.5,15.75 S1.1 42.75,15.75 49.75,15.75 51,17 55.25,17 55.38,16.88 | 55.38,16.88 56.5,15.75 S2.1
  Bottom 0.406: Q2.1 135.5,40 135.5,24.5 126.75,15.75 S7.1
N$6
  Bottom 0.406: Q8.3 102.25,40 102.25,37.75 93.5,29 49,29 F1.P$2 37.75,17.75 37.75,15.75 S1.3
N$7  (via drill 0.3)
  Top 0.406: Q7.3 107.25,40 89.5,22.25 v56.25,22.25
  Bottom 0.406: v56.25,22.25 F2.P$2 51.75,17.75 51.75,15.75 S2.3
N$8  (via drill 0.3)
  Top 0.406: v50.25,56 48,58.25 43.25,58.25 35.75,65.75 29,65.75 25.25,69.5 24.75,69.5 IC7.5 | MAD_SEQUENCES.5 86.5,37.75 84,37.75 MAD_SEQUENCES.4
  Bottom 0.406: v50.25,56 61.5,44.75 74.5,44.75 79.75,39.5 82,39.5 83.75,37.75 MAD_SEQUENCES.4
N$9
  Bottom 0.406: Q5.3 119.25,40 108.25,29 97.25,29 89.75,21.5 83.5,21.5 82,20 F4.P$2 81.75,20 79.75,18 79.75,15.75 S4.3
N$10
  Bottom 0.406: Q4.3 125.25,40 114.25,29 110.25,29 102.75,21.5 97.5,21.5 F5.P$2 93.75,17.75 93.75,15.75 S5.3
N$11
  Bottom 0.406: Q3.3 132.25,40 132.25,37.25 116.5,21.5 111.5,21.5 F6.P$2 107.75,17.75 107.75,15.75 S6.3
N$12
  Top 0.406: Q2.3 137.5,40 124,26.5 124,20 F7.P$2
  Bottom 0.406: S7.3 121.75,15.75 121.75,18 123.75,20 F7.P$2
N$13
  Top 0.406: Q1.3 144.25,40 144.25,26.25 138,20 F8.P$2
  Bottom 0.406: S8.3 135.75,15.75 135.75,18 137.75,20 F8.P$2
N$14
  Top 0.406: F8.P$1 128.25,20 126.75,18.5 123,18.5 121.5,20 F7.P$1 121.25,20 119.75,21.5 109.5,21.5 108,20 F6.P$1 100.5,20 99,21.5 95,21.5 F5.P$1 86.25,20 84.75,18.5 81,18.5 79.5,20 F4.P$1 72.75,20 71.25,18.5 67.5,18.5 66,20 F3.P$1 58.5,20 57,21.5 50.25,21.5 50.12,21.38 | F1.P$1 38,20 39.5,21.5 50,21.5 50.12,21.38 | F2.P$1 50.12,21.38
  Bottom 0.406: R5.P$2 105,47 105,40.75 103,38.75 103,35.75 89.5,22.25 81.75,22.25 79.5,20 F4.P$1
N$15
  Top 0.406: R6.P$1 5.25,47 6.25,47 8.75,49.5 R7.P$2 | IC2.5 29,59.75 29,57.25 IC2.2
  Bottom 0.406: R7.P$2 8.75,49.75 8.75,51.25 3.75,56.25 3.75,58.5 12.75,66.5 32,66.5 33.75,64.75 IC2.5
N$16
  Top 0.406: IC2.3 31.5,57 35.25,53.25 R9.P$2 35.25,53 35.25,49.25 R8.P$2
N$17
  Top 0.406: IC2.1 26.5,57 26.5,54.25 27.5,53.25 R9.P$1
  Bottom 0.406: R10.P$2 27.75,46 27.75,47.25 26.5,48.5 26.5,52 27.5,53 R9.P$1
N$18  (via drill 0.3)
  Top 0.406: v34.25,58.25 36.75,55.75 36.75,47 35.75,46 R10.P$1 35.5,45.75 34,44.25 34,39.75 C2.2
  Bottom 0.406: v34.25,58.25 31.5,61 31.5,64.5 IC2.6
N$19
  Top 0.406: R12.P$2 51.25,64.75 R11.P$1
  Bottom 0.406: IC3.6 43.5,64.5 44.5,64.5 45.5,63.5 50,63.5 51,64.5 R11.P$1
N$20  (via drill 0.3)
  Top 0.406: IC2.7 28.75,64.5 28.75,61 25.25,57.5 25.25,51.75 27.75,49.25 R8.P$1 | v52.75,54.5 52.75,53 47,47.25 44,47.25 36.5,39.75 C2.1
  Bottom 0.406: C2.1 36.25,39.75 36.25,40.75 28,49 R8.P$1 | v52.75,54.5 51.25,56 51.25,57 R11.P$2
N$21  (via drill 0.3)
  Top 0.406: v26.5,28 31.25,28 57.75,54.5 57.75,60.5 57.25,61 52,61 48.5,64.5 46,64.5 IC3.5
  Bottom 0.406: v26.5,28 26.5,19.5 26,19 PWM.P$2
N$22
  Top 0.406: IC3.3 43.5,57 44.5,57 46.25,55.25 52,55.25 53.75,57 R12.P$1 53.5,57 51.5,59 47.5,59 42,64.5 41,64.5 IC3.7
N$23
  Top 0.406: IC3.1 38,57 38,47.25 39.25,46 R13.P$2
N$25  (via drill 0.3)
  Top 0.406: v30,38.25 37.25,38.25 44.75,45.75 47,45.75 R13.P$1
  Bottom 0.406: C3.1 31.25,9.25 30,10.5 30,23.5 27.25,26.25 27.25,37 26.12,38.12 | 26.12,38.12 20.5,43.75 18,43.75 9,52.75 R14.P$2 | v30,38.25 26.25,38.25 26.12,38.12
N$26
  Top 0.406: 18.62,40.38 19.25,41 R18.P$2 | 18.62,40.38 17,38.75 17,37 IC4.5 | R15.P$1 13.25,13 18.75,18.5 18.75,40.25 18.62,40.38
N$27
  Top 0.406: 25.75,8 23.5,8 23,8.5 FILTER.1 | 25.75,8 C3.2 | 25.75,8 21,3.25 R15.P$2
N$28
  Top 0.406: IC4.6 14.25,37 13,37 12,38 6.25,38 4,35.75 R17.P$2 3.75,35.5 1.75,33.5 1.75,14.25 3,13 3,7.5 R16.P$2
N$29
  Top 0.406: IC4.7 11.5,36.75 10.75,36.75 2.5,28.5 2.5,15.5 3,15 R16.P$1
  Bottom 0.406: R19.1 11.5,11 9.25,11 5.5,14.75 3.25,14.75 R16.P$1
N$30
  Top 0.406: IC5.1 9,18.25 9,19.5 4.25,24.25 C6.2 4,24.5 4,27.75 R17.P$1
  Bottom 0.406: R25.P$2 24.25,3 23.5,3 9.25,17.25 9.25,18 IC5.1
N$31
  Top 0.406: IC4.1 8,28 8,25.5 10.25,23.25 10.25,17.75 5.5,13 5.5,11.5 6.75,10.25 6.75,6.75 C4.2
  Bottom 0.406: C4.2 9.75,6.75 11,5.5 16,5.5 17.25,6.75 R20.1 | IC4.1 9.25,29 10.5,29 11.5,28 17.25,28 18,28.75 18,34 15.5,36.5 15.5,37.5 12,41 R18.P$1
N$32
  Top 0.406: R19.2 11.75,6.75 11.75,2.5 12.5,1.75 14.25,1.75 21.5,9 21.5,23.5 23.25,25.25 23.25,29.25 20,32.5 20,39.75 20.75,40.5 20.75,43.5 19.25,45 R21.P$2
N$33
  Top 0.406: R20.2 17.5,11 17.5,13.5 18,14 R22.P$2
N$34
  Top 0.406: R21.P$1 11.75,45 15.5,41.25 15.5,36.5 11.75,32.75 11.75,29.25 IC4.2 11.5,29 10.5,28 10.5,25.5 12.75,23.25 12.75,14.5 10.25,12 7,12 C4.1
N$35
  Top 0.406: IC5.2 11.5,18 11.5,15.25 10.5,14.25 R22.P$1
  Bottom 0.406: C6.1 4.25,19.25 10.5,19.25 11.5,18.25 IC5.2
N$36
  Top 0.406: IC5.7 11.75,25.75 14.25,25.75 IC5.6
N$37
  Top 0.406: R23.P$1 2,46.75 2,50.25 R24.P$2 | IC5.3 14.5,18.25 14.5,24.5 15.5,25.5 15.5,28 14.5,29 IC4.3
  Bottom 0.406: R23.P$1 2.25,46.5 2.25,45.25 10.5,37 10.5,33 14.25,29.25 IC4.3
N$38
  Bottom 0.406: R25.P$1 32.25,3 32.5,3.25 32.5,9 31.25,10.25 C5.1 32.25,15 32.25,37.25 24.25,45.25 24.25,49.75 R26.P$2
N$39
  Top 0.406: FILTER.2 23,11.25 138.5,11.25 145.5,18.25 145.5,58.75 141.25,63 J1.TIP 141,63.25 130,63.25 J1.TIP-NORM
N$40
  Top 0.406: Q1.2 143,40.25 129.75,53.5 127.25,53.5 126,54.75 R27.P$1
N$41
  Top 0.406: C5.2 23,14 FILTER.3
N$42
  Bottom 0.406: Q2.2 137,51.75 132.5,56.25 130.25,56.25 129,55 R28.P$1
N$43  (via drill 0.3)
  Top 0.406: v127.25,40.75 129.75,38.25 131,38.25 Q3.2
  Bottom 0.406: v127.25,40.75 127.25,50.5 123,54.75 R29.P$1
N$44
  Bottom 0.406: Q4.2 125,38.25 126,38.25 130.5,42.75 130.5,53.25 132,54.75 R30.P$1
N$45
  Bottom 0.406: Q5.2 119,38.25 120,38.25 124.25,42.5 124.25,50.5 120,54.75 R31.P$1
N$46
  Bottom 0.406: Q6.2 113,44.5 115.5,47 115.5,53.5 116.75,54.75 R32.P$1
N$47
  Bottom 0.406: Q7.2 107,48.5 113.25,54.75 113.75,54.75 R33.P$1
N$48
  Bottom 0.406: Q8.2 101,45 110.75,54.75 R34.P$1
N$49  (via drill 0.3)
  Top 0.406: C7.1 39,72.5 41.75,69.75 43.25,69.75 IC6.1 43.5,69.5 45.75,67.25 53.25,67.25 60.5,60 v60.5,59.5
  Bottom 0.406: v60.5,59.5 63.25,59.5 71.25,51.5 71.25,49 VR1.P$3
N$50  (via drill 0.3)
  Top 0.406: IC7.10 29.75,77.25 32.25,74.75 41.25,74.75 45.75,70.25 45.75,69.75 IC6.2 46,69.5 47.5,68 53.5,68 61.25,60.25 v61.25,56
  Bottom 0.406: v61.25,56 68.25,49 68.75,49 VR1.P$2
N$51  (via drill 0.3)
  Top 0.406: v65,73 65,66.75 85.25,46.5 85.25,41.5 81.5,37.75 MAD_SEQUENCES.3
  Bottom 0.406: v65,73 59,79 42.75,79 41.25,77.5 32.5,77.5 IC7.9
N$52  (via drill 0.3)
  Top 0.406: v42.75,72.25 41,74 28,74 24.75,77.25 IC7.12 | v69.5,72.25 95.25,46.5 95.25,38.75 94.25,37.75 MAD_SEQUENCES.8
  Bottom 0.406: v69.5,72.25 v42.75,72.25
N$53  (via drill 0.3)
  Top 0.406: v23.5,56.25 23.5,70.75 24.25,71.5 25.25,71.5 27,69.75 IC7.6
  Bottom 0.406: v23.5,56.25 23.5,55.5 24.5,54.5 28.25,54.5 33.25,49.5 33.25,47.75 33.75,47.25 47.5,47.25 56.25,38.5 56.25,35.25 57,34.5 73.25,34.5 76.25,37.5 MAD_SEQUENCES.1
N$54
  Top 0.406: MAD_SEQUENCES.10 91.75,45.25 94,45.25 MAD_SEQUENCES.9
  Bottom 0.406: MAD_SEQUENCES.14 81.5,45.5 83.25,47.25 84.75,47.25 86.5,45.5 MAD_SEQUENCES.12 86.75,45.5 94.25,53 | 94.25,53 94.25,45.5 MAD_SEQUENCES.9 | 94.25,53 94.25,54.5 102.25,62.5 109.5,62.5 115.25,68.25 IC8.11
N$55
  Top 0.406: MAD_SEQUENCES.15 79,45.5 80.75,47.25 82,47.25 83.75,45.5 MAD_SEQUENCES.13
  Bottom 0.406: 91.12,43.38 89.25,45.25 MAD_SEQUENCES.11 | 91.12,43.38 91.25,43.25 94.5,43.25 95.25,44 95.25,46.75 105.75,57.25 119.25,57.25 121.5,59.5 121.5,61.75 118,65.25 118,68.25 IC8.10 | MAD_SEQUENCES.13 84,45.25 86,43.25 91,43.25 91.12,43.38
N$56  (via drill 0.3)
  Top 0.406: v78,49.5 78,47 76.5,45.5 MAD_SEQUENCES.16
  Bottom 0.406: v78,49.5 99.25,70.75 117.5,70.75 119.75,68.5 120.25,68.5 IC8.9
N$57  (via drill 0.3)
  Top 0.406: v77.25,47.75 75.25,47.75 68.25,40.75 SEQUENCER.2
  Bottom 0.406: v77.25,47.75 99.5,70 115.75,70 116.5,69.25 116.5,67.25 115.5,66.25 115.5,60.75 IC8.6
N$58
  Bottom 0.406: R35.P$2 57.75,36 60,36 67.25,43.25 68,43.25 SEQUENCER.3
N$59  (via drill 0.3)
  Top 0.406: v109.25,49.75 109.25,61.75 110.25,62.75 110.25,68.25 IC8.13
  Bottom 0.406: v109.25,49.75 109.25,48.75 110.75,47.25 R34.P$2
N$60
  Top 0.406: IC8.14 107.5,68.25 107.5,62.75 106.5,61.75 106.5,58.25 108.5,56.25 108.5,49.5 109.5,48.5 112.5,48.5 113.75,47.25 R33.P$2
N$61  (via drill 0.3)
  Top 0.406: v107.25,56.5 104,59.75 104,61.75 105,62.75 105,68.25 IC8.15
  Bottom 0.406: v107.25,56.5 117,56.5 118.25,55.25 118.25,48.5 117,47.25 R32.P$2
N$62
  Top 0.406: IC8.12 113,68.25 113,65.25 116.75,61.5 116.75,59.5 120,56.25 120.25,56.25 121.5,55 121.5,53.5 127.25,47.75 127.25,46.75 126.25,45.75 121.25,45.75 120,47 R31.P$2
N$63
  Top 0.406: IC8.1 102.75,60.5 102.75,53.25 111,45 130,45 132,47 R30.P$2
N$64  (via drill 0.3)
  Top 0.406: v121.5,49.25 118.5,52.25 118.5,55 113,60.5 IC8.5
  Bottom 0.406: v121.5,49.25 121.5,48.5 122.75,47.25 R29.P$2
N$65
  Top 0.406: IC8.2 105.25,60.75 105.25,62 106.5,63.25 106.5,69.25 107.25,70 118.25,70 119.25,69 119.25,59.75 122.75,56.25 123.25,56.25 124.5,55 124.5,51.5 128.75,47.25 R28.P$2
N$66
  Top 0.406: IC8.4 110.5,60.5 110.5,60 115.5,55 115.5,54.25 121.25,48.5 124.5,48.5 125.75,47.25 R27.P$2
N$67
  Top 0.406: IC7.7 29.75,69.5 30.25,69.5 32.5,67.25 44.75,67.25 46.75,65.25 48.75,65.25 52.25,61.75 57.5,61.75 59.75,59.5 59.75,43.75 67.75,35.75 77,35.75 78.75,37.5 MAD_SEQUENCES.2
N$68  (via drill 0.3)
  Top 0.406: v57,60.25 48.75,60.25 44.75,64.25 44.75,64.75 43,66.5 30.75,66.5 28.5,68.75 28.5,70.5 26.75,72.25 24,72.25 22.25,70.5 22.25,69.75 IC7.4 | MAD_SEQUENCES.7 91.5,37.75 89.25,37.75 MAD_SEQUENCES.6
  Bottom 0.406: v57,60.25 63.75,60.25 77.75,46.25 77.75,44 81.5,40.25 86.5,40.25 89,37.75 MAD_SEQUENCES.6
N$69
  Top 0.406: Q6.3 113.25,40 102.25,29 97.25,29 89.75,21.5 70,21.5 68.5,20 F3.P$2
  Bottom 0.406: S3.3 65.75,15.75 65.75,17.5 68.25,20 F3.P$2
N$70
  Top 0.406: IC6.3 48.5,69.75 50.75,69.75 IC6.4
N$71
  Top 0.406: IC6.5 53.5,69.75 56,69.75 IC6.6
N$72
  Top 0.406: IC6.9 56.25,77.5 58.5,77.5 IC6.8
N$73
  Top 0.406: IC6.11 51,77.5 53.25,77.5 IC6.10
N$74
  Top 0.406: IC6.13 46,77.5 48.25,77.5 IC6.12
VCC
  Top 0.406: 8,70.75 14,64.75 IC1.8 14,64.5 14,62 3.75,51.75 3.75,39.25 | 8,70.75 14.5,77.25 IC7.16 14.5,77.5 15,77.5 16.5,79 41.75,79 43.25,77.5 IC6.14 43.5,77.25 45.25,75.5 62,75.5 | 8,70.75 POWER.+ | 3.75,39.25 5,39.25 R6.P$2 | 3.75,39.25 2.25,39.25 R23.P$2 | SEQUENCER.1 68,38 67.25,38 62,43.25 R1.P$2 62,43.5 62,75.5 | 62,75.5 67.25,75.5 74.25,68.5 102.5,68.5 IC8.16
  Bottom 0.406: IC2.8 26.25,64.5 23,64.5 22,63.5 15.25,63.5 14.25,64.5 IC1.8 | 8.38,36.12 9,36.75 IC4.8 | 8.38,36.12 8,35.75 8,28.75 9,27.75 9,26 IC5.8 10.25,24.75 11.75,24.75 17.5,19 PWM.P$1 | 8.38,36.12 5.25,39.25 R6.P$2 | IC3.8 38.25,64.75 38.25,69.75 43.25,74.75 43.25,77.25 IC6.14

### Text on the board
tPlace: Towards new universes of sound / TALLER BOCUMA GDL MX 2019. | "BEWARE; / FOR I AM / FEARLESS, / AND THEREFORE / POWERFUL." / - FRANKENSTEIN. | FRANKIE DIY KIT REV B. CC BY-NC-SA 4.0. www.bocuma.mx